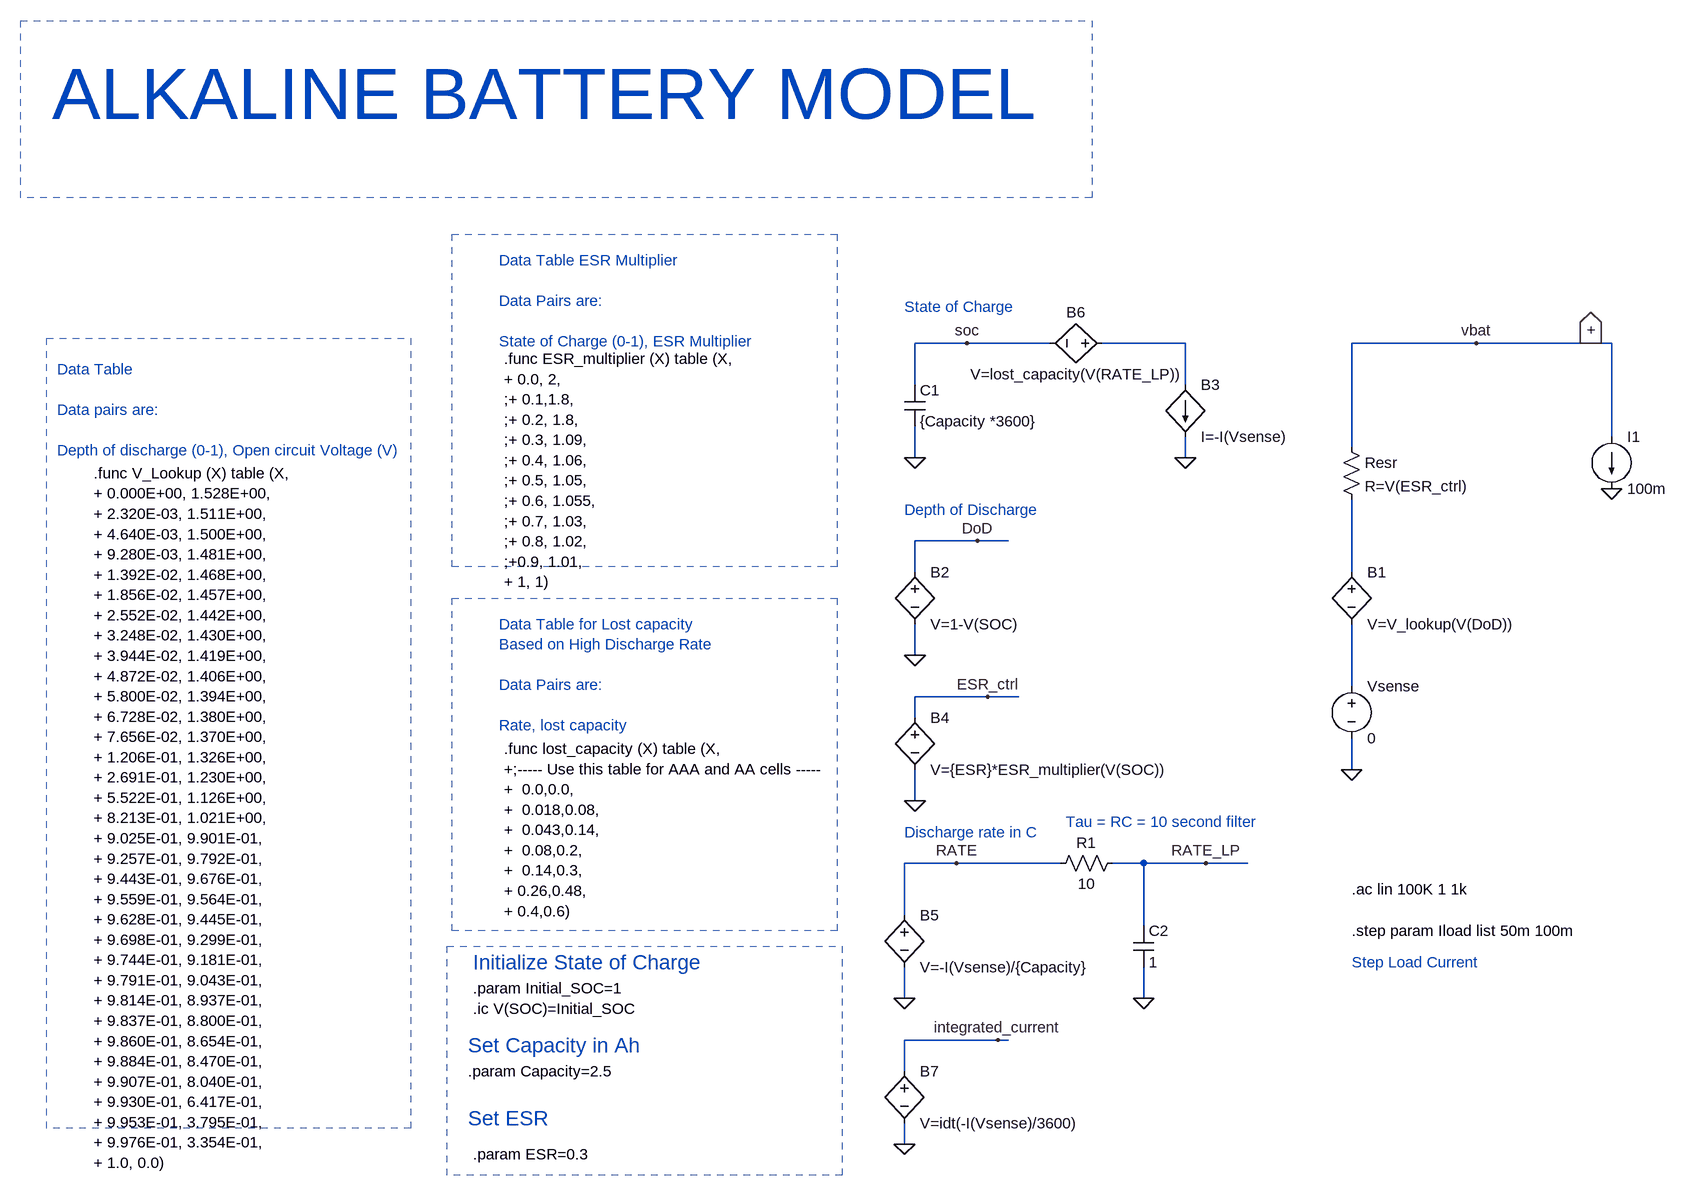
[diagram p0: schematic BatteryModel.asc]
BatteryModel.asc, the LTspice schematic file:
Version 4
SHEET 1 1368 1456
WIRE -2112 -192 -2192 -192
WIRE -1984 -192 -2112 -192
WIRE -1776 -192 -1904 -192
WIRE -1328 -192 -1520 -192
WIRE -1152 -192 -1328 -192
WIRE -1120 -192 -1152 -192
WIRE -2192 -128 -2192 -192
WIRE -1776 -128 -1776 -192
WIRE -1120 -48 -1120 -192
WIRE -1520 -32 -1520 -192
WIRE -2192 -16 -2192 -64
WIRE -1776 -16 -1776 -48
WIRE -2096 112 -2192 112
WIRE -2048 112 -2096 112
WIRE -2192 160 -2192 112
WIRE -1520 160 -1520 48
WIRE -2192 288 -2192 240
WIRE -1520 336 -1520 240
WIRE -2080 352 -2192 352
WIRE -2032 352 -2080 352
WIRE -2192 384 -2192 352
WIRE -1520 464 -1520 416
WIRE -2192 512 -2192 464
WIRE -2128 608 -2208 608
WIRE -1968 608 -2128 608
WIRE -1840 608 -1888 608
WIRE -1744 608 -1840 608
WIRE -1680 608 -1744 608
WIRE -2208 688 -2208 608
WIRE -1840 704 -1840 608
WIRE -2208 816 -2208 768
WIRE -1840 816 -1840 768
WIRE -2064 880 -2208 880
WIRE -2048 880 -2064 880
WIRE -2208 928 -2208 880
WIRE -2208 1040 -2208 1008
FLAG -2192 -16 0
FLAG -1520 464 0
FLAG -2192 288 0
FLAG -2096 112 DoD
FLAG -1776 -16 0
FLAG -2192 512 0
FLAG -2080 352 ESR_ctrl
FLAG -2208 816 0
FLAG -2128 608 RATE
FLAG -1840 816 0
FLAG -1744 608 RATE_LP
FLAG -2208 1040 0
FLAG -2064 880 integrated_current
FLAG -1328 -192 vbat
FLAG -2112 -192 soc
FLAG -1152 -192 +
IOPIN -1152 -192 Out
FLAG -1120 32 0
SYMBOL bv -1520 144 R0
SYMATTR InstName B1
SYMATTR Value V=V_lookup(V(DoD))
SYMBOL bv -2192 144 R0
SYMATTR InstName B2
SYMATTR Value V=1-V(SOC)
SYMBOL cap -2208 -128 R0
SYMATTR InstName C1
SYMATTR Value {Capacity *3600}
SYMBOL voltage -1520 320 R0
SYMATTR InstName Vsense
SYMATTR Value 0
SYMBOL bi -1776 -128 R0
SYMATTR InstName B3
SYMATTR Value I=-I(Vsense)
SYMBOL res -1536 -48 R0
SYMATTR InstName Resr
SYMATTR Value R=V(ESR_ctrl)
SYMBOL bv -2192 368 R0
SYMATTR InstName B4
SYMATTR Value V={ESR}*ESR_multiplier(V(SOC))
SYMBOL bv -2208 672 R0
SYMATTR InstName B5
SYMATTR Value V=-I(Vsense)/{Capacity}
SYMBOL res -1872 592 R90
WINDOW 0 0 56 VBottom 2
WINDOW 3 32 56 VTop 2
SYMATTR InstName R1
SYMATTR Value 10
SYMBOL cap -1856 704 R0
SYMATTR InstName C2
SYMATTR Value 1
SYMBOL bv -1888 -192 R90
WINDOW 0 -32 56 VBottom 2
WINDOW 3 32 56 VTop 2
SYMATTR InstName B6
SYMATTR Value V=lost_capacity(V(RATE_LP))
SYMBOL bv -2208 912 R0
SYMATTR InstName B7
SYMATTR Value V=idt(-I(Vsense)/3600)
SYMBOL current -1120 -48 R0
SYMATTR InstName I1
SYMATTR Value 100m
TEXT -2208 -248 Left 2 ;State of Charge
TEXT -2208 64 Left 2 ;Depth of Discharge
TEXT -3456 8 Left 2 !.func V_Lookup (X) table (X, \n+ 0.000E+00, 1.528E+00,\n+ 2.320E-03, 1.511E+00,\n+ 4.640E-03, 1.500E+00,\n+ 9.280E-03, 1.481E+00,\n+ 1.392E-02, 1.468E+00,\n+ 1.856E-02, 1.457E+00,\n+ 2.552E-02, 1.442E+00,\n+ 3.248E-02, 1.430E+00,\n+ 3.944E-02, 1.419E+00,\n+ 4.872E-02, 1.406E+00,\n+ 5.800E-02, 1.394E+00,\n+ 6.728E-02, 1.380E+00,\n+ 7.656E-02, 1.370E+00,\n+ 1.206E-01, 1.326E+00, \n+ 2.691E-01, 1.230E+00,\n+ 5.522E-01, 1.126E+00,\n+ 8.213E-01, 1.021E+00,\n+ 9.025E-01, 9.901E-01,\n+ 9.257E-01, 9.792E-01,\n+ 9.443E-01, 9.676E-01,\n+ 9.559E-01, 9.564E-01,\n+ 9.628E-01, 9.445E-01,\n+ 9.698E-01, 9.299E-01,\n+ 9.744E-01, 9.181E-01,\n+ 9.791E-01, 9.043E-01,\n+ 9.814E-01, 8.937E-01, \n+ 9.837E-01, 8.800E-01,\n+ 9.860E-01, 8.654E-01,\n+ 9.884E-01, 8.470E-01,\n+ 9.907E-01, 8.040E-01,\n+ 9.930E-01, 6.417E-01,\n+ 9.953E-01, 3.795E-01,\n+ 9.976E-01, 3.354E-01,\n+ 1.0, 0.0)
TEXT -1520 648 Left 2 !.ac lin 100K 1 1k
TEXT -3512 -152 Left 2 ;Data Table\n \nData pairs are:\n \nDepth of discharge (0-1), Open circuit Voltage (V)
TEXT -2880 928 Left 2 !.param Capacity=2.5
TEXT -2872 800 Left 2 !.param Initial_SOC=1
TEXT -2872 832 Left 2 !.ic V(SOC)=Initial_SOC
TEXT -2872 760 Left 3 ;Initialize State of Charge
TEXT -2880 888 Left 3 ;Set Capacity in Ah
TEXT -1520 712 Left 2 !.step param Iload list 50m 100m
TEXT -1520 760 Left 2 ;Step Load Current
TEXT -2880 1000 Left 3 ;Set ESR
TEXT -2872 1056 Left 2 !.param ESR=0.3
TEXT -2824 -168 Left 2 !.func ESR_multiplier (X) table (X,\n+ 0.0, 2,\n;+ 0.1,1.8,\n;+ 0.2, 1.8,\n;+ 0.3, 1.09,\n;+ 0.4, 1.06,\n;+ 0.5, 1.05,\n;+ 0.6, 1.055,\n;+ 0.7, 1.03,\n;+ 0.8, 1.02,\n;+0.9, 1.01,\n+ 1, 1)
TEXT -2832 -320 Left 2 ;Data Table ESR Multiplier\n \nData Pairs are:\n \nState of Charge (0-1), ESR Multiplier
TEXT -2208 560 Left 2 ;Discharge rate in C
TEXT -1960 544 Left 2 ;Tau = RC = 10 second filter
TEXT -2832 240 Left 2 ;Data Table for Lost capacity\nBased on High Discharge Rate\n \nData Pairs are:\n \nRate, lost capacity
TEXT -2824 432 Left 2 !.func lost_capacity (X) table (X,\n+;----- Use this table for AAA and AA cells -----\n+  0.0,0.0,\n+  0.018,0.08,\n+  0.043,0.14,\n+  0.08,0.2,\n+  0.14,0.3,\n+ 0.26,0.48,\n+ 0.4,0.6)
TEXT -3520 -576 Left 7 ;ALKALINE BATTERY MODEL
RECTANGLE Normal -2968 1016 -3528 -200 2
RECTANGLE Normal -2312 712 -2904 200 2
RECTANGLE Normal -2312 152 -2904 -360 2
RECTANGLE Normal -2304 1088 -2912 736 2
RECTANGLE Normal -1920 -416 -3568 -688 2

The netlist it stands for:
* BatteryModel.asc
B1 N002 N003 V=V_lookup(V(DoD))
B2 DoD 0 V=1-V(SOC)
C1 soc 0 {Capacity *3600}
Vsense N003 0 0
B3 N001 0 I=-I(Vsense)
Resr + N002 R=V(ESR_ctrl)
B4 ESR_ctrl 0 V={ESR}*ESR_multiplier(V(SOC))
B5 RATE 0 V=-I(Vsense)/{Capacity}
R1 RATE_LP RATE 10
C2 RATE_LP 0 1
B6 N001 soc V=lost_capacity(V(RATE_LP))
B7 integrated_current 0 V=idt(-I(Vsense)/3600)
I1 + 0 100m
* State of Charge
* Depth of Discharge
.func V_Lookup (X) table (X,
+ 0.000E+00, 1.528E+00,
+ 2.320E-03, 1.511E+00,
+ 4.640E-03, 1.500E+00,
+ 9.280E-03, 1.481E+00,
+ 1.392E-02, 1.468E+00,
+ 1.856E-02, 1.457E+00,
+ 2.552E-02, 1.442E+00,
+ 3.248E-02, 1.430E+00,
+ 3.944E-02, 1.419E+00,
+ 4.872E-02, 1.406E+00,
+ 5.800E-02, 1.394E+00,
+ 6.728E-02, 1.380E+00,
+ 7.656E-02, 1.370E+00,
+ 1.206E-01, 1.326E+00,
+ 2.691E-01, 1.230E+00,
+ 5.522E-01, 1.126E+00,
+ 8.213E-01, 1.021E+00,
+ 9.025E-01, 9.901E-01,
+ 9.257E-01, 9.792E-01,
+ 9.443E-01, 9.676E-01,
+ 9.559E-01, 9.564E-01,
+ 9.628E-01, 9.445E-01,
+ 9.698E-01, 9.299E-01,
+ 9.744E-01, 9.181E-01,
+ 9.791E-01, 9.043E-01,
+ 9.814E-01, 8.937E-01,
+ 9.837E-01, 8.800E-01,
+ 9.860E-01, 8.654E-01,
+ 9.884E-01, 8.470E-01,
+ 9.907E-01, 8.040E-01,
+ 9.930E-01, 6.417E-01,
+ 9.953E-01, 3.795E-01,
+ 9.976E-01, 3.354E-01,
+ 1.0, 0.0)
.ac lin 100K 1 1k
* Data Table
* Data pairs are:
* Depth of discharge (0-1), Open circuit Voltage (V)
.param Capacity=2.5
.param Initial_SOC=1
.ic V(SOC)=Initial_SOC
* Initialize State of Charge
* Set Capacity in Ah
.step param Iload list 50m 100m
* Step Load Current
* Set ESR
.param ESR=0.3
.func ESR_multiplier (X) table (X,
+ 0.0, 2,
;+ 0.1,1.8,
;+ 0.2, 1.8,
;+ 0.3, 1.09,
;+ 0.4, 1.06,
;+ 0.5, 1.05,
;+ 0.6, 1.055,
;+ 0.7, 1.03,
;+ 0.8, 1.02,
;+0.9, 1.01,
+ 1, 1)
* Data Table ESR Multiplier
* Data Pairs are:
* State of Charge (0-1), ESR Multiplier
* Discharge rate in C
* Tau = RC = 10 second filter
* Data Table for Lost capacity
* Based on High Discharge Rate
* Data Pairs are:
* Rate, lost capacity
.func lost_capacity (X) table (X,
+;----- Use this table for AAA and AA cells -----
+  0.0,0.0,
+  0.018,0.08,
+  0.043,0.14,
+  0.08,0.2,
+  0.14,0.3,
+ 0.26,0.48,
+ 0.4,0.6)
* ALKALINE BATTERY MODEL
.backanno
.end